# EAGLE design Control Board (EAGLE 8.0.1)
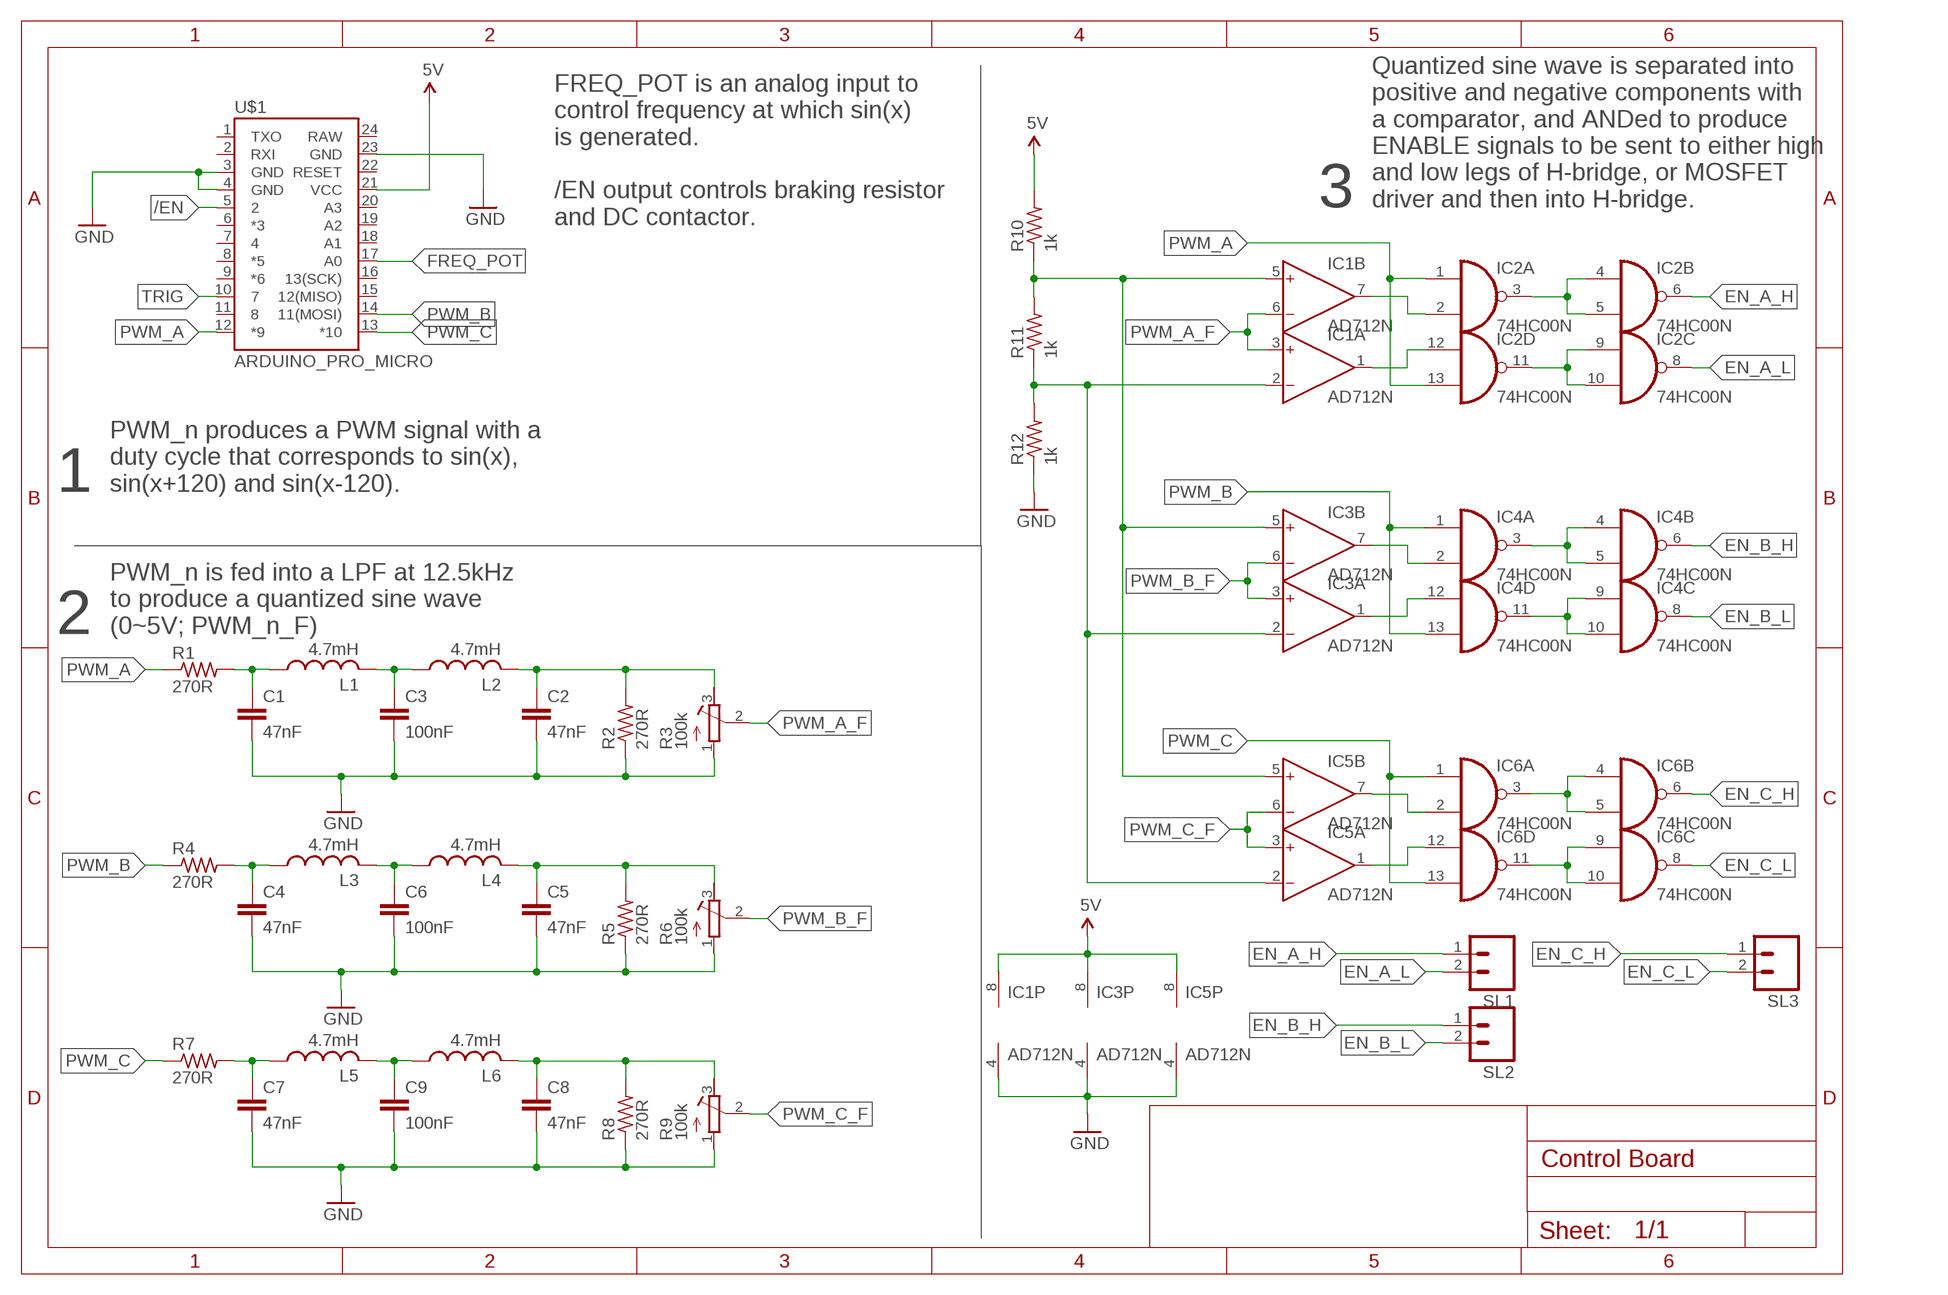
[diagram p0: schematic, sheet 1]
FRAME1 (A4L-LOC): REVISION: 1

## Parts
C1  47nF  C-EU025-025X050  [C025-025X050]
C2  47nF  C-EU025-025X050  [C025-025X050]
C3  100nF  C-EU025-025X050  [C025-025X050]
C4  47nF  C-EU025-025X050  [C025-025X050]
C5  47nF  C-EU025-025X050  [C025-025X050]
C6  100nF  C-EU025-025X050  [C025-025X050]
C7  47nF  C-EU025-025X050  [C025-025X050]
C8  47nF  C-EU025-025X050  [C025-025X050]
C9  100nF  C-EU025-025X050  [C025-025X050]
IC1  AD712N  [DIL08]
IC2  74HC00N  [DIL14]
IC3  AD712N  [DIL08]
IC4  74HC00N  [DIL14]
IC5  AD712N  [DIL08]
IC6  74HC00N  [DIL14]
L1  4.7mH  L-US0207/12  [0207/12]
L2  4.7mH  L-US0207/12  [0207/12]
L3  4.7mH  L-US0207/12  [0207/12]
L4  4.7mH  L-US0207/12  [0207/12]
L5  4.7mH  L-US0207/12  [0207/12]
L6  4.7mH  L-US0207/12  [0207/12]
R1  270R  R-US_0207/7  [0207/7]
R2  270R  R-US_0207/7  [0207/7]
R3  100k  R-TRIMM3296W  [RTRIM3296W]
R4  270R  R-US_0207/7  [0207/7]
R5  270R  R-US_0207/7  [0207/7]
R6  100k  R-TRIMM3296W  [RTRIM3296W]
R7  270R  R-US_0207/7  [0207/7]
R8  270R  R-US_0207/7  [0207/7]
R9  100k  R-TRIMM3296W  [RTRIM3296W]
R10  1k  R-US_0207/7  [0207/7]
R11  1k  R-US_0207/7  [0207/7]
R12  1k  R-US_0207/7  [0207/7]
SL1  M02PTH  [1X02]
SL2  M02PTH  [1X02]
SL3  M02PTH  [1X02]
U$1  ARDUINO_PRO_MICRO  [ARDUINO_PRO_MICRO]

## Nets
/EN: U$1.5
EN_A_H: IC2.6(B:O) SL1.1
EN_A_L: IC2.8(C:O) SL1.2
EN_B_H: IC4.6(B:O) SL2.1
EN_B_L: IC4.8(C:O) SL2.2
EN_C_H: IC6.6(B:O) SL3.1
EN_C_L: IC6.8(C:O) SL3.2
FREQ_POT: U$1.17(A0)
GND: C1.2 C2.2 C3.2 C4.2 C5.2 C6.2 C7.2 C8.2 C9.2 IC1.4(P:V-) IC3.4(P:V-) IC5.4(P:V-) R2.1 R3.1(A) R5.1 R6.1(A) R8.1 R9.1(A) R12.1 U$1.3(GND) U$1.4(GND) U$1.23(GND)
N$1: C1.1 L1.1 R1.2
N$2: C3.1 L1.2 L2.1
N$3: C2.1 L2.2 R2.2 R3.3(E)
N$4: C4.1 L3.1 R4.2
N$5: C6.1 L3.2 L4.1
N$6: C5.1 L4.2 R5.2 R6.3(E)
N$7: C7.1 L5.1 R7.2
N$8: C9.1 L5.2 L6.1
N$9: C8.1 L6.2 R8.2 R9.3(E)
N$10: IC1.7(B:OUT) IC2.2(A:I1)
N$11: IC1.1(A:OUT) IC2.12(D:I0)
N$12: IC3.7(B:OUT) IC4.2(A:I1)
N$13: IC1.5(B:IN+) IC3.5(B:IN+) IC5.5(B:IN+) R10.1 R11.2
N$14: IC1.2(A:IN-) IC3.2(A:IN-) IC5.2(A:IN-) R11.1 R12.2
N$15: IC3.1(A:OUT) IC4.12(D:I0)
N$16: IC5.7(B:OUT) IC6.2(A:I1)
N$17: IC5.1(A:OUT) IC6.12(D:I0)
N$18: IC2.3(A:O) IC2.4(B:I0) IC2.5(B:I1)
N$19: IC2.9(C:I0) IC2.10(C:I1) IC2.11(D:O)
N$20: IC4.3(A:O) IC4.4(B:I0) IC4.5(B:I1)
N$21: IC4.9(C:I0) IC4.10(C:I1) IC4.11(D:O)
N$22: IC6.9(C:I0) IC6.10(C:I1) IC6.11(D:O)
N$23: IC6.3(A:O) IC6.4(B:I0) IC6.5(B:I1)
PWM_A: IC2.1(A:I0) IC2.13(D:I1) R1.1 U$1.12(*9)
PWM_A_F: IC1.3(A:IN+) IC1.6(B:IN-) R3.2(S)
PWM_B: IC4.1(A:I0) IC4.13(D:I1) R4.1 U$1.14(11(MOSI))
PWM_B_F: IC3.3(A:IN+) IC3.6(B:IN-) R6.2(S)
PWM_C: IC6.1(A:I0) IC6.13(D:I1) R7.1 U$1.13(*10)
PWM_C_F: IC5.3(A:IN+) IC5.6(B:IN-) R9.2(S)
TRIG: U$1.10
VCC: IC1.8(P:V+) IC3.8(P:V+) IC5.8(P:V+) R10.2 U$1.21(VCC) ; supply symbol labelled 5V
Unconnected: U$1.1(TXO) U$1.2(RXI) U$1.6(*3) U$1.7 U$1.8(*5) U$1.9(*6) U$1.11 U$1.15(12(MISO)) U$1.16(13(SCK)) U$1.18(A1) U$1.19(A2) U$1.20(A3) U$1.22(RESET) U$1.24(RAW)

## Notes on the sheet
- 3
- Quantized sine wave is separated into
  positive and negative components with
  a comparator, and ANDed to produce
  ENABLE signals to be sent to either high
  and low legs of H-bridge, or MOSFET
  driver and then into H-bridge.
- FREQ_POT is an analog input to
  control frequency at which sin(x)
  is generated.
  
  /EN output controls braking resistor
  and DC contactor.
- 1
- PWM_n produces a PWM signal with a
  duty cycle that corresponds to sin(x),
  sin(x+120) and sin(x-120).
- 2
- PWM_n is fed into a LPF at 12.5kHz
  to produce a quantized sine wave
  (0~5V; PWM_n_F)

## Power pins joined to a net without a drawn wire
GND: IC2.7(P:GND) IC4.7(P:GND) IC6.7(P:GND)
VCC: IC2.14(P:VCC) IC4.14(P:VCC) IC6.14(P:VCC)

## Library data of the parts
C1-C9 = resistor:C-EU: CAPACITOR, European symbol
IC1 IC3 IC5 = analog-devices:AD712: Dual Precision, Low Cost, High Speed BiFET Op Amp Source: http://www.analog.com/static/imported-files/data_sheets/AD712.pdf; MF: ALTERA CORPORATION; MPN: AD712JNZ; OC_FARNELL: 9604898; OC_NEWARK: 59K4554
IC2 IC4 IC6 = 74xx-eu:74*00: Quad 2-input NAND gate
L1-L6 = resistor:L-US: INDUCTOR, American symbol
R1 R2 R4 R5 R7 R8 R10-R12 = resistor:R-US_: RESISTOR, American symbol
R3 R6 R9 = resistor:R-TRIMM: Trimm resistor
SL1-SL3 = SparkFun-Connectors:M02: Standard 2-pin 0.1" header. Use with - straight break away headers ( PRT-00116) - right angle break away headers (PRT-00553) - swiss pins (PRT-00743) - machine pins (PRT-00117) - female headers (PRT-00115) Molex polarized connector foot print use with: PRT-08233 with associated crimp pins and housings. 2.54_SCREWTERM for use with PRT-10571. 3.5mm Screw Terminal footprints for PRT-08084 5mm Screw Terminal footprints for use with PRT-08432
U$1 = SparkFun-Boards:ARDUINO_PRO_MICRO

## Board
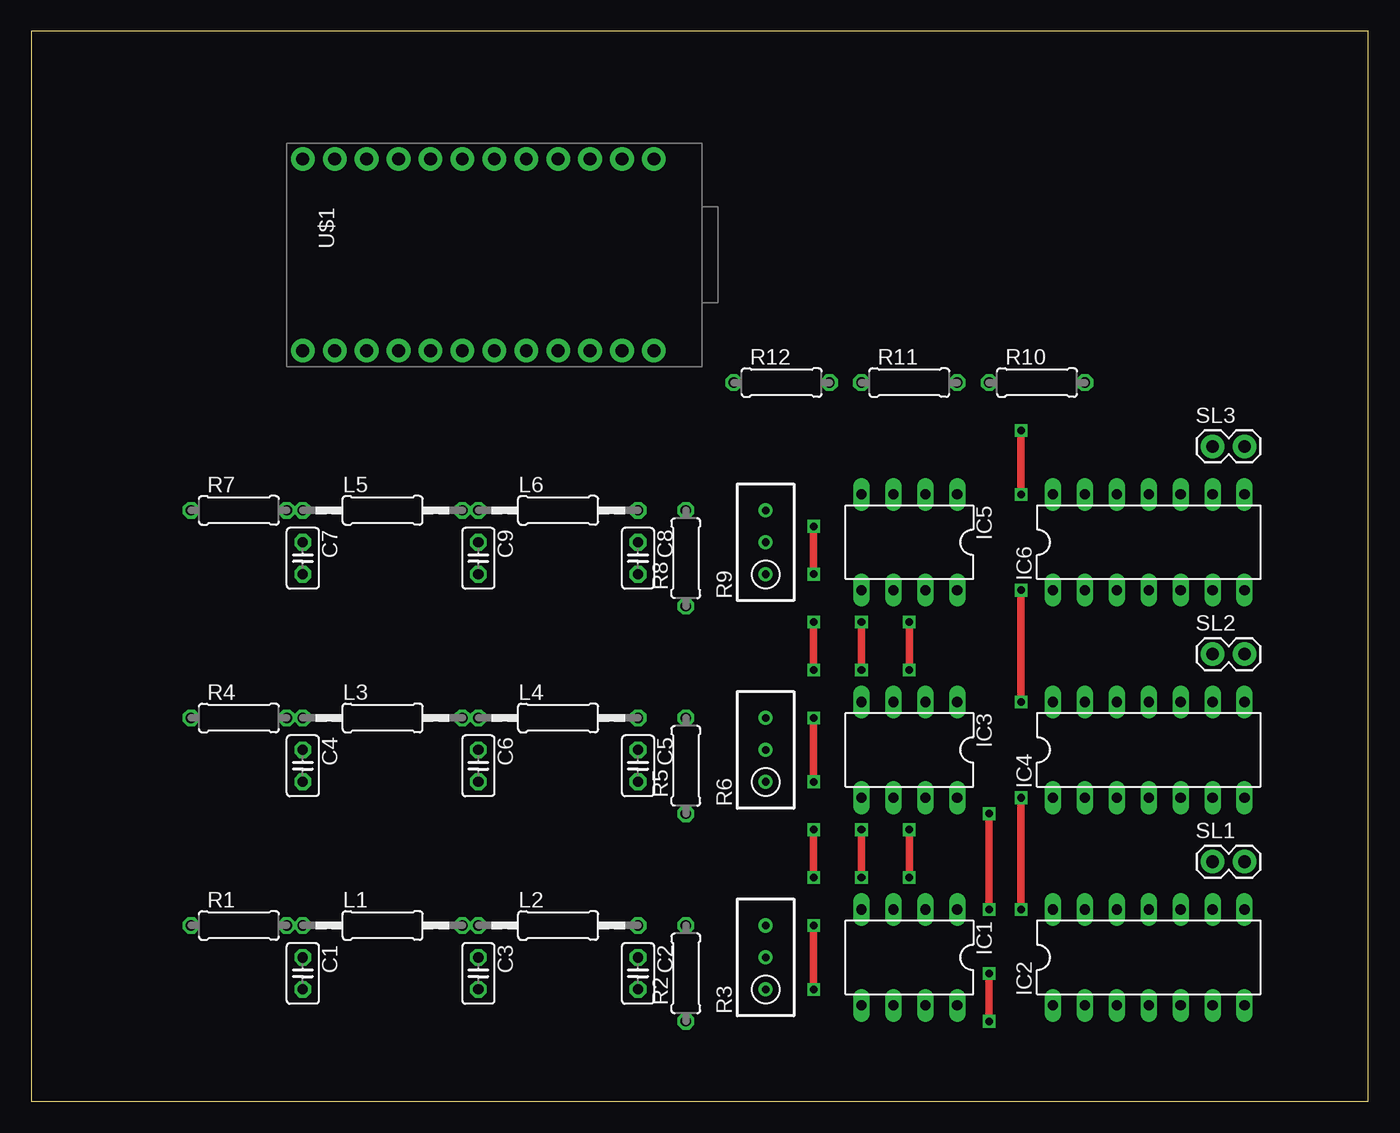
[diagram p1: board, top side]
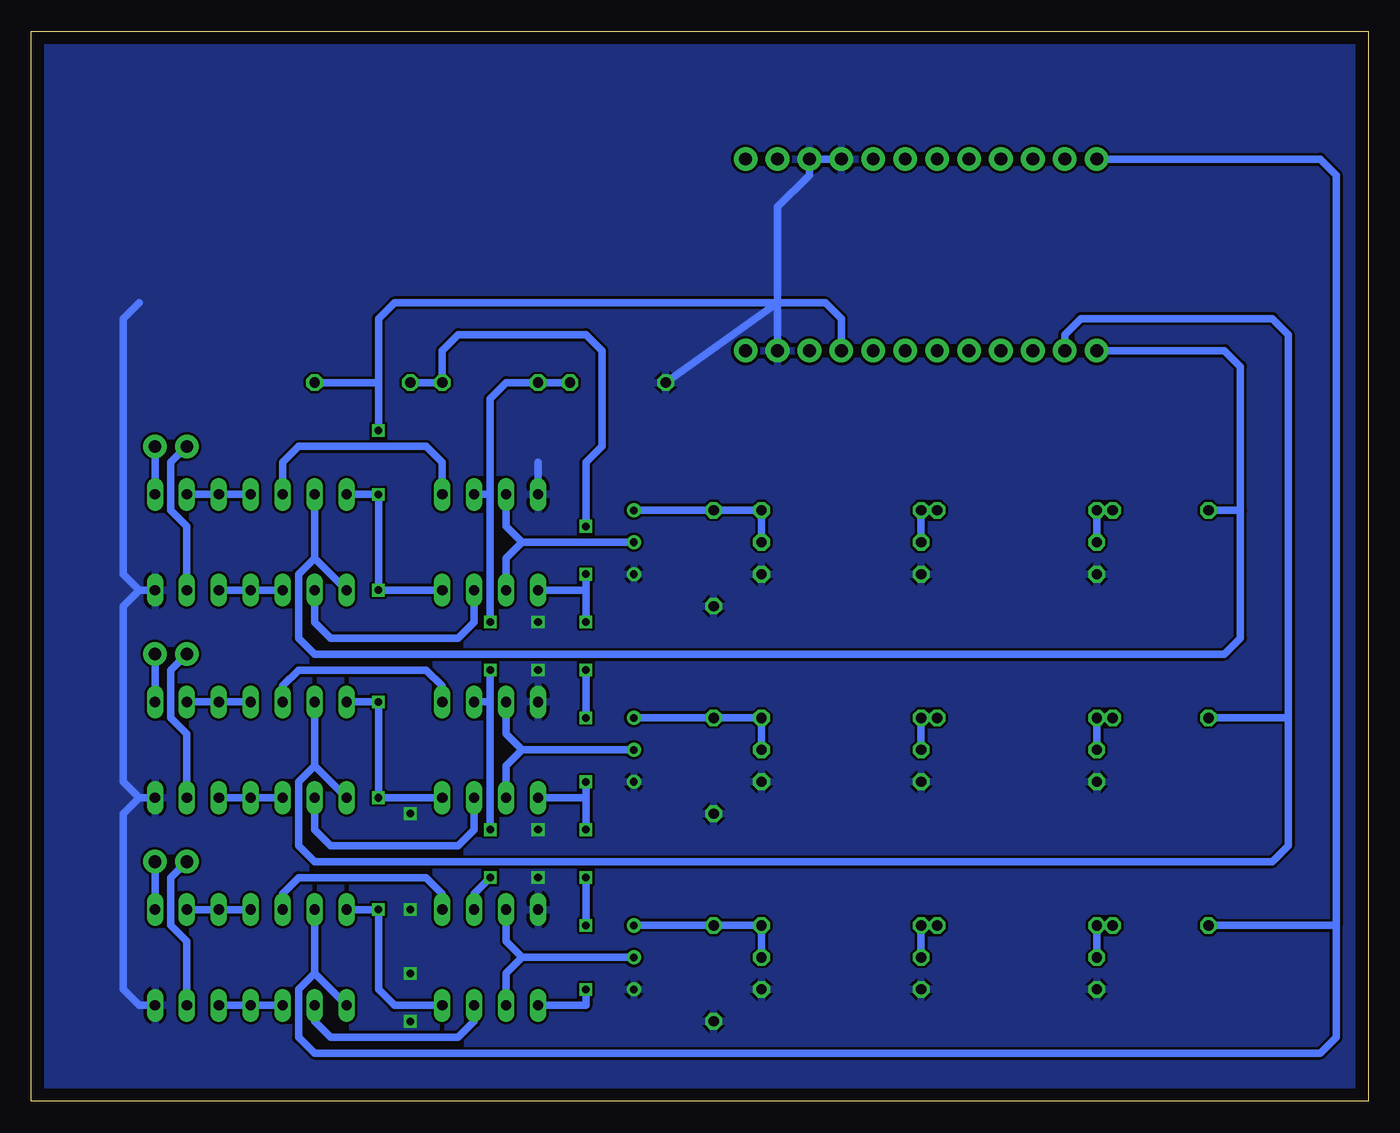
[diagram p2: board, bottom side, seen from below]

Size 106.35 x 85.08 mm. Coordinates in mm from the lower left corner, seen from the top.
Outline: 0,0 106.35,0 106.35,85.08 0,85.08 0,0
Copper layers (1*16): Top 0.035mm / dielectric 1.5mm / Bottom 0.035mm
Design rules "default": minimum track width 10mil, minimum drill 24mil, track to track 8mil, track to pad 8mil, pad to pad 8mil, via to via 8mil, smd to smd 8mil, copper to edge 40mil, drill to drill 8mil, minimum pad ring 10mil, minimum via ring 8mil, stop-mask expansion 4mil, vias tented up to drill 0mil, thermal gap 10mil

### Footprints (pad centres in the part's own frame; a part is rotated, then mirrored left to right if it is on the bottom)
C025-025X050 = drill 0.813 octagon: 1 -1.27,0; 2 1.27,0
DIL08 = drill 0.813 long: 1 -3.81,-3.81; 2 -1.27,-3.81; 3 1.27,-3.81; 4 3.81,-3.81; 5 3.81,3.81; 6 1.27,3.81; 7 -1.27,3.81; 8 -3.81,3.81
DIL14 = drill 0.813 long: 1 -7.62,-3.81; 2 -5.08,-3.81; 3 -2.54,-3.81; 4 0,-3.81; 5 2.54,-3.81; 6 5.08,-3.81; 7 7.62,-3.81; 8 7.62,3.81; 9 5.08,3.81; 10 2.54,3.81; 11 0,3.81; 12 -2.54,3.81; 13 -5.08,3.81; 14 -7.62,3.81
0207/12 = drill 0.813 octagon: 1 -6.35,0; 2 6.35,0
0207/7 = drill 0.813 octagon: 1 -3.81,0; 2 3.81,0
RTRIM3296W = drill 0.61: 1 0,-2.54; 2 0,0; 3 0,2.54
1X02 = drill 1.016 pad 1.88: 1 0,0; 2 2.54,0
ARDUINO_PRO_MICRO = drill 1.016 pad 1.88: 1 -7.62,12.7; 2 -7.62,10.16; 3 -7.62,7.62; 4 -7.62,5.08; 5 -7.62,2.54; 6 -7.62,0; 7 -7.62,-2.54; 8 -7.62,-5.08; 9 -7.62,-7.62; 10 -7.62,-10.16; 11 -7.62,-12.7; 12 -7.62,-15.24; 13 7.62,-15.24; 14 7.62,-12.7; 15 7.62,-10.16; 16 7.62,-7.62; 17 7.62,-5.08; 18 7.62,-2.54; 19 7.62,0; 20 7.62,2.54; 21 7.62,5.08; 22 7.62,7.62; 23 7.62,10.16; 24 7.62,12.7

### Placement (x,y rotation side)
C1  21.59,10.16 270 top
C2  48.26,10.16 270 top
C3  35.56,10.16 270 top
C4  21.59,26.67 270 top
C5  48.26,26.67 270 top
C6  35.56,26.67 270 top
C7  21.59,43.18 270 top
C8  48.26,43.18 270 top
C9  35.56,43.18 270 top
IC1  69.85,11.43 180 top
IC2  88.9,11.43 0 top
IC3  69.85,27.94 180 top
IC4  88.9,27.94 0 top
IC5  69.85,44.45 180 top
IC6  88.9,44.45 0 top
L1  27.94,13.97 0 top
L2  41.91,13.97 0 top
L3  27.94,30.48 0 top
L4  41.91,30.48 0 top
L5  27.94,46.99 0 top
L6  41.91,46.99 0 top
R1  16.51,13.97 0 top
R2  52.07,10.16 90 top
R3  58.42,11.43 0 top
R4  16.51,30.48 0 top
R5  52.07,26.67 90 top
R6  58.42,27.94 0 top
R7  16.51,46.99 0 top
R8  52.07,43.18 90 top
R9  58.42,44.45 0 top
R10  80.01,57.15 0 top
R11  69.85,57.15 0 top
R12  59.69,57.15 0 top
SL1  93.98,19.05 0 top
SL2  93.98,35.56 0 top
SL3  93.98,52.07 0 top
U$1  36.83,67.31 270 top

### Tracks (layer width: path | path; a pad name or v marks a point on that pad's centre or on a via)
EN_A_H
  Bottom 0.61: SL1.1 95.25,17.78 95.25,13.97 93.98,12.7 IC2.6
EN_A_L
  Bottom 0.61: SL1.2 IC2.8
EN_B_H
  Bottom 0.61: SL2.1 95.25,34.29 95.25,30.48 93.98,29.21 IC4.6
EN_B_L
  Bottom 0.61: SL2.2 IC4.8
EN_C_H
  Bottom 0.61: IC6.6 93.98,45.72 95.25,46.99 95.25,50.8 SL3.1
EN_C_L
  Bottom 0.61: SL3.2 IC6.8
GND  (via drill 0.6)
  Top 0.61: v66.04,21.59 v66.04,17.78 | v66.04,38.1 v66.04,34.29 | v76.2,15.24 v76.2,22.86 | v76.2,10.16 v76.2,6.35
  Bottom 0.61: 97.79,24.13 99.06,22.86 99.06,8.89 97.79,7.62 IC2.7 | IC4.7 97.79,24.13 | 97.79,24.13 99.06,25.4 99.06,39.37 97.79,40.64 | 97.79,40.64 IC6.7 | 97.79,63.5 99.06,62.23 99.06,41.91 97.79,40.64 | IC5.4 66.04,50.8 | U$1.4 U$1.3 44.45,73.66 46.99,71.12 U$1.23 46.99,63.5 R12.1
  pour Bottom: 0,85.09 106.68,85.09 106.68,0 0,0
N$1
  Bottom 0.61: R1.2 L1.1 C1.1
N$2
  Bottom 0.61: L1.2 L2.1 C3.1
N$3
  Bottom 0.61: R3.3 R2.2 L2.2 C2.1
N$4
  Bottom 0.61: R4.2 L3.1 C4.1
N$5
  Bottom 0.61: L3.2 L4.1 C6.1
N$6
  Bottom 0.61: C5.1 L4.2 R5.2 R6.3
N$7
  Bottom 0.61: C7.1 L5.1 R7.2
N$8
  Bottom 0.61: C9.1 L6.1 L5.2
N$9
  Bottom 0.61: R9.3 R8.2 L6.2 C8.1
N$10
  Bottom 0.61: IC1.7 71.12,6.35 72.39,5.08 82.55,5.08 83.82,6.35 IC2.2
N$11
  Bottom 0.61: IC2.12 86.36,16.51 85.09,17.78 74.93,17.78 73.66,16.51 IC1.1
N$12
  Bottom 0.61: IC4.2 83.82,21.59 82.55,20.32 72.39,20.32 71.12,21.59 IC3.7
N$13  (via drill 0.6)
  Top 0.61: v62.23,45.72 v62.23,41.91 | v62.23,30.48 v62.23,25.4 | v62.23,13.97 v62.23,8.89 | v62.23,21.59 v62.23,17.78 | v62.23,38.1 v62.23,34.29
  Bottom 0.61: R10.1 R11.2 73.66,59.69 72.39,60.96 62.23,60.96 60.96,59.69 60.96,52.07 62.23,50.8 v62.23,45.72 | v62.23,41.91 62.23,40.64 | v62.23,25.4 62.23,24.13 | v62.23,8.89 62.23,7.62 IC1.5 | IC3.5 62.23,24.13 | IC5.5 62.23,40.64 | 62.23,24.13 v62.23,21.59 | v62.23,17.78 v62.23,13.97 | 62.23,40.64 v62.23,38.1 | v62.23,34.29 v62.23,30.48
N$14  (via drill 0.6)
  Top 0.61: v69.85,21.59 v69.85,17.78 | v69.85,34.29 v69.85,38.1
  Bottom 0.61: v69.85,21.59 69.85,31.75 | IC3.2 69.85,31.75 | IC1.2 71.12,16.51 v69.85,17.78 | 69.85,31.75 v69.85,34.29 | v69.85,38.1 69.85,48.26 | 69.85,48.26 IC5.2 | R12.2 R11.1 68.58,57.15 69.85,55.88 69.85,48.26
N$15
  Bottom 0.61: IC4.12 86.36,33.02 85.09,34.29 74.93,34.29 73.66,33.02 IC3.1
N$16
  Bottom 0.61: IC5.7 71.12,38.1 72.39,36.83 82.55,36.83 83.82,38.1 IC6.2
N$17
  Bottom 0.61: IC6.12 86.36,50.8 85.09,52.07 74.93,52.07 73.66,50.8 IC5.1
N$18
  Bottom 0.61: IC2.3 IC2.4 IC2.5
N$19
  Bottom 0.61: IC2.9 IC2.10 IC2.11
N$20
  Bottom 0.61: IC4.5 IC4.4 IC4.3
N$21
  Bottom 0.61: IC4.9 IC4.10 IC4.11
N$22
  Bottom 0.61: IC6.9 IC6.10 IC6.11
N$23
  Bottom 0.61: IC6.4 IC6.5 IC6.3
PWM_A
  Bottom 0.61: R1.1 2.54,13.97 | 2.54,13.97 2.54,5.08 3.81,3.81 83.82,3.81 85.09,5.08 85.09,8.89 83.82,10.16 | IC2.13 83.82,10.16 | 83.82,10.16 IC2.1 | U$1.12 3.81,74.93 2.54,73.66 2.54,13.97
PWM_A_F
  Bottom 0.61: R3.2 67.31,11.43 | IC1.3 68.58,12.7 67.31,11.43 | 67.31,11.43 68.58,10.16 IC1.6
PWM_B
  Bottom 0.61: 6.35,30.48 6.35,60.96 7.62,62.23 22.86,62.23 24.13,60.96 U$1.14 | 6.35,30.48 6.35,20.32 7.62,19.05 83.82,19.05 85.09,20.32 85.09,25.4 83.82,26.67 | 6.35,30.48 R4.1 | IC4.13 83.82,26.67 | 83.82,26.67 IC4.1
PWM_B_F
  Bottom 0.61: R6.2 67.31,27.94 | IC3.3 68.58,29.21 67.31,27.94 | 67.31,27.94 68.58,26.67 IC3.6
PWM_C
  Bottom 0.61: IC6.13 83.82,43.18 | IC6.1 83.82,43.18 | 83.82,43.18 85.09,41.91 85.09,36.83 83.82,35.56 11.43,35.56 10.16,36.83 10.16,46.99 | 10.16,46.99 10.16,58.42 11.43,59.69 U$1.13 | R7.1 10.16,46.99
PWM_C_F
  Bottom 0.61: R9.2 67.31,44.45 | 67.31,44.45 68.58,45.72 IC5.3 | IC5.6 68.58,43.18 67.31,44.45
VCC  (via drill 0.6)
  Top 0.61: v78.74,15.24 v78.74,24.13 | v78.74,40.64 v78.74,31.75 | v78.74,48.26 v78.74,53.34
  Bottom 0.61: IC2.14 v78.74,15.24 78.74,8.89 77.47,7.62 IC1.8 | IC4.14 v78.74,31.75 v78.74,24.13 IC3.8 | U$1.21 41.91,62.23 43.18,63.5 77.47,63.5 78.74,62.23 78.74,57.15 | IC6.14 v78.74,48.26 v78.74,40.64 IC5.8 | R10.2 78.74,57.15 | v78.74,53.34 78.74,57.15